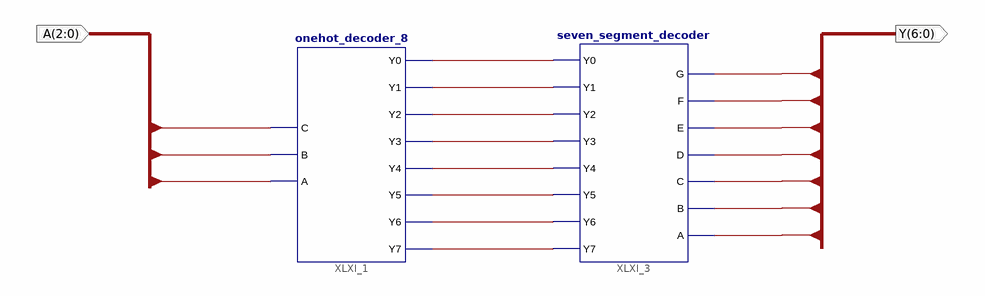
[diagram p0: schematic sheet 1]
// Xilinx ISE schematic binary_to_7seg_decoder.sch (zynq) as structural Verilog: 2 symbols, 2 ports
module binary_to_7seg_decoder (
  input  [2:0] A,
  output [6:0] Y
);

  wire D0, D1, D2, D3, D4, D5, D6, D7;

  onehot_decoder_8 XLXI_1 (
    .B(A[1]), .Y0(D0), .Y1(D1), .Y2(D2), .Y3(D3), .Y4(D4), .Y5(D5), .Y6(D6), .Y7(D7), .A(A[0]), .C(A[2]));
  seven_segment_decoder XLXI_3 (
    .Y7(D7), .Y6(D6), .Y4(D4), .Y3(D3), .Y2(D2), .Y1(D1), .Y0(D0), .Y5(D5), .A(Y[0]), .B(Y[1]), .C(Y[2]),
    .D(Y[3]), .E(Y[4]), .F(Y[5]), .G(Y[6]));
endmodule
